# EAGLE design GenieSteroids (EAGLE 5.11)
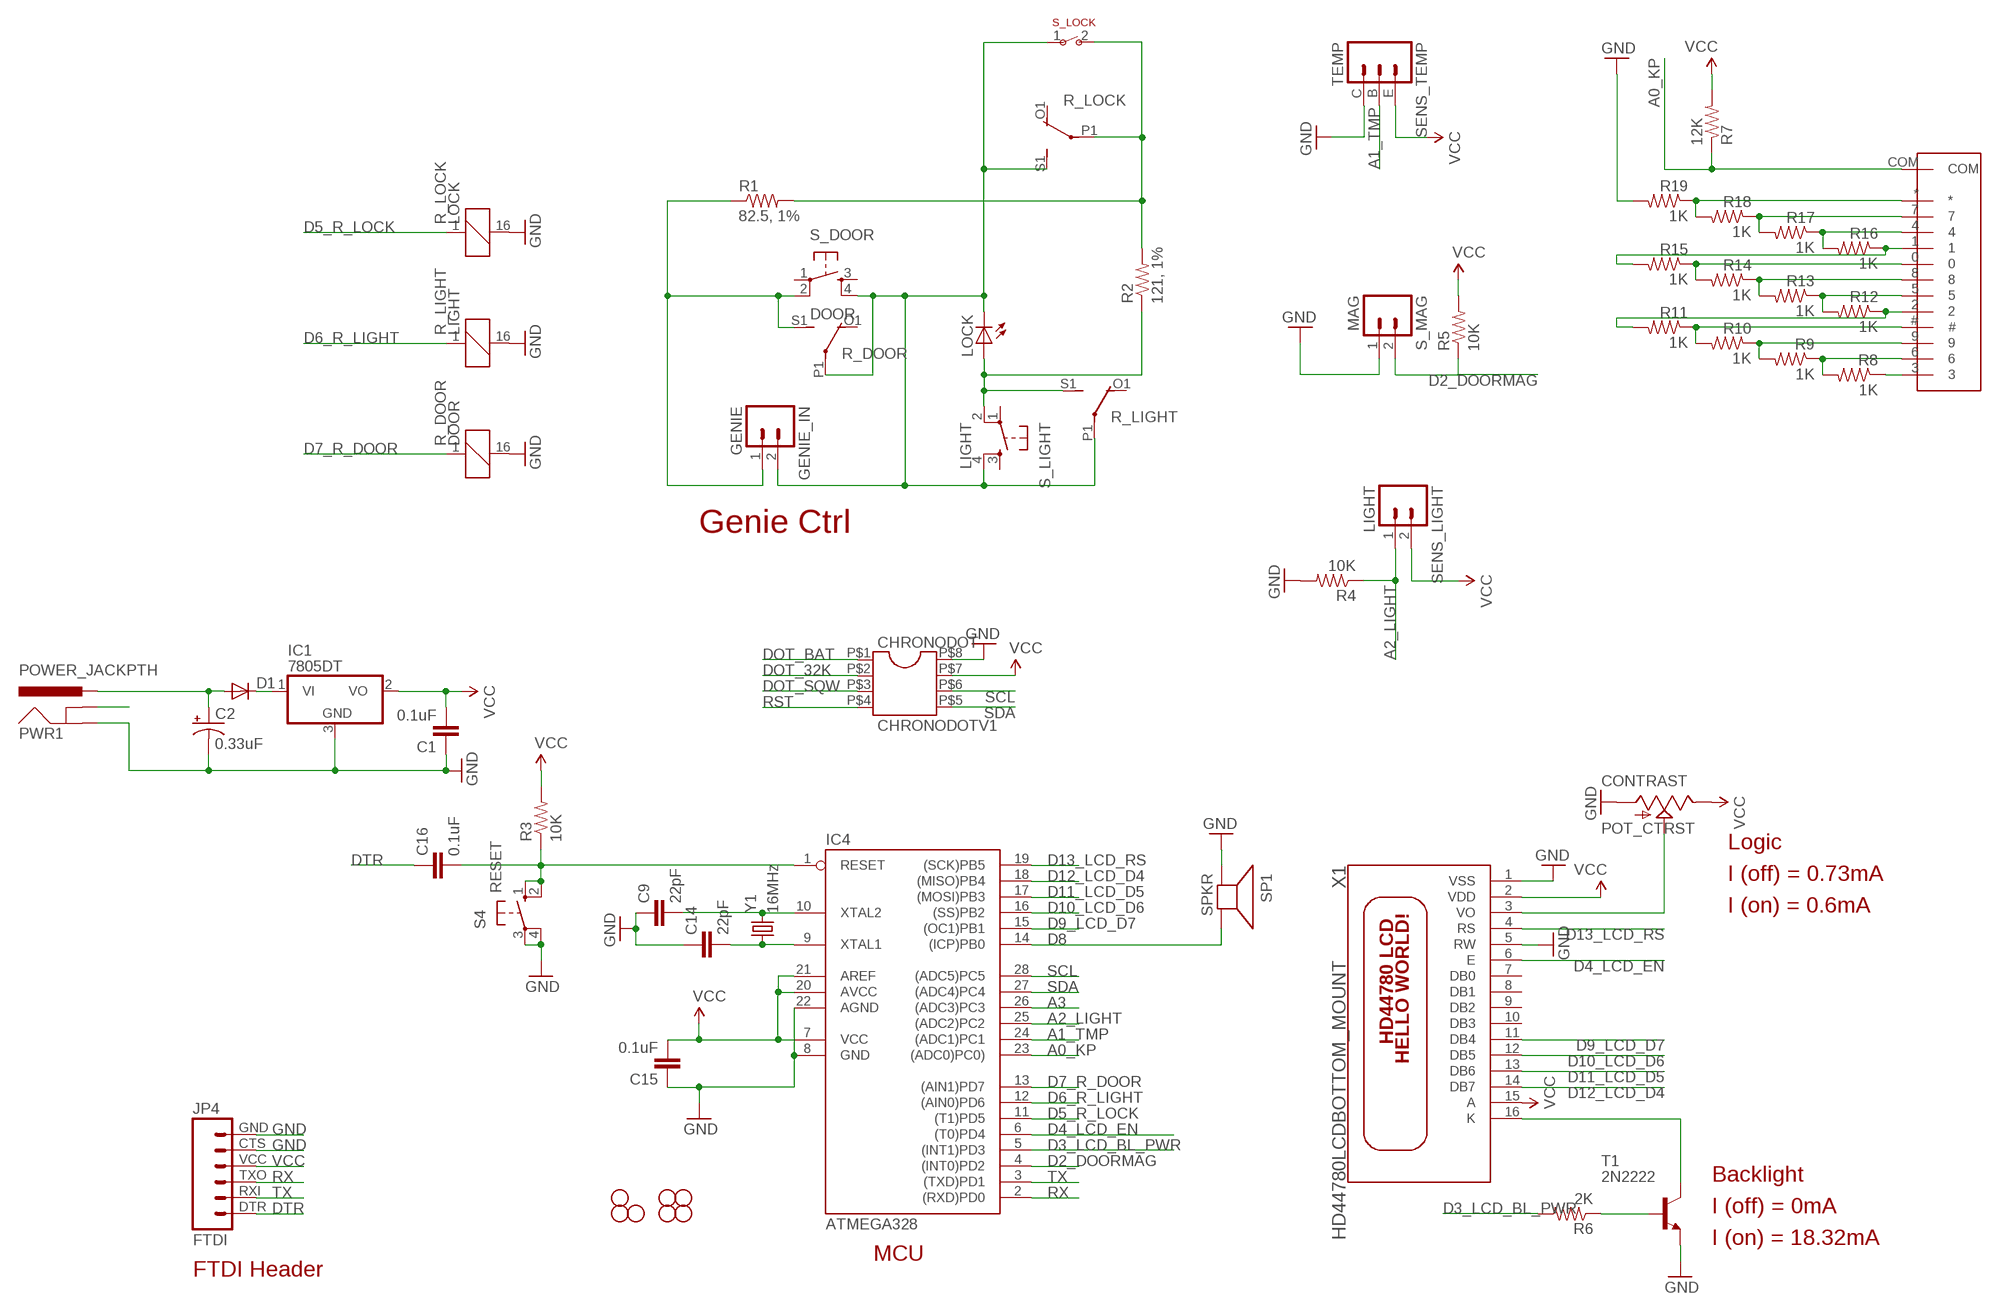
[diagram p0: schematic, sheet 1]

## Parts
C1  0.1uF  CAPPTH1  [CAP-PTH-5MM]
C2  0.33uF  CAP_POLPTH1  [CPOL-RADIAL-100UF-25V]
C9  22pF  CAPPTH  [CAP-PTH-SMALL]
C14  22pF  CAPPTH  [CAP-PTH-SMALL]
C15  0.1uF  CAPPTH  [CAP-PTH-SMALL]
C16  0.1uF  CAPPTH1  [CAP-PTH-5MM]
CHRONODOT  CHRONODOTV1  [CHRONODOT]
D1  DIODEPTH  [DIODE-1N4001]
GENIE_IN  GENIE  M023.5MM  [SCREWTERMINAL-3.5MM-2]
IC1  7805DT  [TO252]
IC4  ATMEGA328  AT90S4433P  [DIL28-3]
JP1  STAND-OFF#2  [STAND-OFF-#2]
JP2  STAND-OFF#2  [STAND-OFF-#2]
JP3  STAND-OFF#2  [STAND-OFF-#2]
JP4  FTDI  FTDI_BASICPTH  [FTDI_BASIC]
JP5  STAND-OFF#2  [STAND-OFF-#2]
JP7  STAND-OFF  [STAND-OFF]
JP8  STAND-OFF  [STAND-OFF]
JP9  STAND-OFF  [STAND-OFF]
LOCK  LED5MM  [LED5MM]
POT_CTRST  CONTRAST  POTVERT  [POT_TRIM_MINI]
PWR1  POWER_JACKPTH  [POWER_JACK_PTH]
R1  82.5, 1%  RESISTORAXIAL-0.3  [AXIAL-0.3]
R2  121, 1%  RESISTORAXIAL-0.3  [AXIAL-0.3]
R3  10K  RESISTORAXIAL-0.3  [AXIAL-0.3]
R4  10K  RESISTORAXIAL-0.3  [AXIAL-0.3]
R5  10K  RESISTORAXIAL-0.3  [AXIAL-0.3]
R6  2K  RESISTORAXIAL-0.3  [AXIAL-0.3]
R7  12K  RESISTORAXIAL-0.3  [AXIAL-0.3]
R8  1K  RESISTORAXIAL-0.3  [AXIAL-0.3]
R9  1K  RESISTORAXIAL-0.3  [AXIAL-0.3]
R10  1K  RESISTORAXIAL-0.3  [AXIAL-0.3]
R11  1K  RESISTORAXIAL-0.3  [AXIAL-0.3]
R12  1K  RESISTORAXIAL-0.3  [AXIAL-0.3]
R13  1K  RESISTORAXIAL-0.3  [AXIAL-0.3]
R14  1K  RESISTORAXIAL-0.3  [AXIAL-0.3]
R15  1K  RESISTORAXIAL-0.3  [AXIAL-0.3]
R16  1K  RESISTORAXIAL-0.3  [AXIAL-0.3]
R17  1K  RESISTORAXIAL-0.3  [AXIAL-0.3]
R18  1K  RESISTORAXIAL-0.3  [AXIAL-0.3]
R19  1K  RESISTORAXIAL-0.3  [AXIAL-0.3]
R_DOOR  DOOR  RELAY-DPDT5V  [D3423]
R_LIGHT  LIGHT  RELAY-DPDT5V  [D3423]
R_LOCK  LOCK  RELAY-DPDT5V  [D3423]
S4  RESET  10-XX  [B3F-10XX]
S_DOOR  DOOR  TAC_SWITCH12MM  [TACTILE-PTH-12MM]
S_LIGHT  LIGHT  TAC_SWITCH12MM  [TACTILE-PTH-12MM]
S_LOCK  LOCK  SWITCH-SPST3.5MMSCREW_TERMINAL  [SCREWTERMINAL-3.5MM-2]
S_MAG  MAG  M023.5MM  [SCREWTERMINAL-3.5MM-2]
SENS_LIGHT  LIGHT  LIGHTSENSORPADS  [1X02_LOCK_LONGPADS]
SENS_TEMP  TEMP  TMP36PTH  [TO92-EBC-OVAL]
SP1  SPKR  SPEAKER/PS12  [PS12]
T1  2N2222  [TO92-EBC-OVAL]
U$2  KEYPAD_12KGENERIC  [KEYPAD_12K]
X1  HD44780LCDBOTTOM_MOUNT  [LCD1602-BOTTOMMOUNT]
Y1  16MHz  CRYSTALHC49US  [HC49US]

## Nets
A0_KP: IC4.23((ADC0)PC0)) R7.P$1 U$2.COM
A1_TMP: IC4.24((ADC1)PC1) SENS_TEMP.B
A2_LIGHT: IC4.25((ADC2)PC2) R4.P$1 SENS_LIGHT.1
A3: IC4.26((ADC3)PC3)
D2_DOORMAG: IC4.4((INT0)PD2) R5.P$1 S_MAG.2
D3_LCD_BL_PWR: IC4.5((INT1)PD3) R6.P$2
D4_LCD_EN: IC4.6((T0)PD4) X1.6(E)
D5_R_LOCK: IC4.11((T1)PD5) R_LOCK.1
D6_R_LIGHT: IC4.12((AIN0)PD6) R_LIGHT.1
D7_R_DOOR: IC4.13((AIN1)PD7) R_DOOR.1
D8: IC4.14((ICP)PB0) SP1.P$2(-)
D9_LCD_D7: IC4.15((OC1)PB1) X1.11(DB4)
D10_LCD_D6: IC4.16((SS)PB2) X1.12(DB5)
D11_LCD_D5: IC4.17((MOSI)PB3) X1.13(DB6)
D12_LCD_D4: IC4.18((MISO)PB4) X1.14(DB7)
D13_LCD_RS: IC4.19((SCK)PB5) X1.4(RS)
DOT_32K: CHRONODOT.P$2
DOT_BAT: CHRONODOT.P$1
DOT_SQW: CHRONODOT.P$3
DTR: C16.1 JP4.DTR
GND [power]: C1.1 C2.2(-) C9.1 C14.1 C15.1 CHRONODOT.P$8 IC1.3(GND) IC4.8(GND) IC4.22(AGND) JP4.CTS JP4.GND POT_CTRST.P$1(A) PWR1.GND R4.P$2 R19.P$2 R_DOOR.16 R_LIGHT.16 R_LOCK.16 S4.3(P) S4.4(P1) S_MAG.1 SENS_TEMP.C SP1.P$1(+) T1.E X1.1(VSS) X1.5(RW)
N$1: GENIE_IN.1 R1.P$1 R_DOOR.S1(2:S) S_DOOR.2
N$2: R1.P$2 R2.P$2 R_LOCK.P1(2:P) S_LOCK.2
N$3 [power]: C2.1(+) D1.A PWR1.PWR
N$4: LOCK.A R2.P$1 R_LIGHT.S1(2:S) S_LIGHT.2
N$5: POT_CTRST.P$2(S) X1.3(VO)
N$6 [power]: D1.C IC1.1(VI)
N$7: R6.P$1 T1.B
N$8: T1.C X1.16(K)
N$10: R8.P$1 U$2.3
N$11: R8.P$2 R9.P$1 U$2.6
N$12: R9.P$2 R10.P$1 U$2.9
N$13: R10.P$2 R11.P$1 U$2.#
N$14: R11.P$2 R12.P$1 U$2.2
N$15: R12.P$2 R13.P$1 U$2.5
N$16: R13.P$2 R14.P$1 U$2.8
N$17: R16.P$2 R17.P$1 U$2.4
N$18: R14.P$2 R15.P$1 U$2.0
N$19: R15.P$2 R16.P$1 U$2.1
N$20: R17.P$2 R18.P$1 U$2.7
N$21: R18.P$2 R19.P$1 U$2.*
N$22 [power]: PWR1.GNDBREAK
RST: C16.2 CHRONODOT.P$4 IC4.1(RESET) R3.P$1 S4.1(S) S4.2(S1)
RX: IC4.2((RXD)PD0) JP4.TXO
S3: GENIE_IN.2 LOCK.K(C) R_DOOR.P1(2:P) R_LIGHT.P1(2:P) R_LOCK.S1(2:S) S_DOOR.4 S_LIGHT.4 S_LOCK.1
SCL: CHRONODOT.P$6 IC4.28((ADC5)PC5)
SDA: CHRONODOT.P$5 IC4.27((ADC4)PC4)
TX: IC4.3((TXD)PD1) JP4.RXI
VCC [power]: C1.2 C15.2 CHRONODOT.P$7 IC1.2(VO) IC4.7(VCC) IC4.20(AVCC) IC4.21(AREF) JP4.VCC POT_CTRST.P$3(E) R3.P$2 R5.P$2 R7.P$2 SENS_LIGHT.2 SENS_TEMP.E X1.2(VDD) X1.15(A)
XTAL1: C14.2 IC4.9(XTAL1) Y1.1
XTAL2: C9.2 IC4.10(XTAL2) Y1.2
Unconnected: R_DOOR.O1(2:O) R_DOOR.O2(3:O) R_DOOR.P2(3:P) R_DOOR.S2(3:S) R_LIGHT.O1(2:O) R_LIGHT.O2(3:O) R_LIGHT.P2(3:P) R_LIGHT.S2(3:S) R_LOCK.O1(2:O) R_LOCK.O2(3:O) R_LOCK.P2(3:P) R_LOCK.S2(3:S) S_DOOR.1 S_DOOR.3 S_LIGHT.1 S_LIGHT.3 X1.7(DB0) X1.8(DB1) X1.9(DB2) X1.10(DB3)

## Notes on the sheet
- Genie Ctrl
- Logic
- I (off) = 0.73mA
- I (on) = 0.6mA
- Backlight
- I (off) = 0mA
- I (on) = 18.32mA
- MCU
- FTDI Header

## Library data of the parts
C1 C9 C14-C16 = SparkFun:CAP: Capacitor Standard 0603 ceramic capacitor, and 0.1" leaded capacitor.
C2 = SparkFun:CAP_POL: Capacitor Polarized These are standard SMD and PTH capacitors. Normally 10uF, 47uF, and 100uF in electrolytic and tantalum varieties. Always verify the external diameter of the through hole cap, it varies with capacity, voltage, and manufacturer. The EIA devices should be standard.
CHRONODOT = Dek:CHRONODOT
D1 = SparkFun:DIODE: Diode These are standard reverse protection diodes and small signal diodes. SMA package can handle up to about 1A. SOD-323 can handle about 200mA. What the SOD-323 package when ordering, there are some mfgs out there that are 5-pin packages.
GENIE_IN S_MAG = SparkFun:M02: Header 2 Standard 2-pin 0.1" header. Use with straight break away headers (SKU : PRT-00116), right angle break away headers (PRT-00553), swiss pins (PRT-00743), machine pins (PRT-00117), and female headers (PRT-00115). Molex polarized connector foot print use with SKU : PRT-08233 with associated crimp pins and housings.
IC1 = adafruit:78*: Positive VOLTAGE REGULATOR Added bigger pads to the TO-92 package
IC4 = atmel:AT90S4433: MICROCONTROLLER 4 Kbytes FLASH 128 bytes SRAM 256 bytes EEPROM UART 6-channel 10 bit ADC; OC_FARNELL: unknown; OC_NEWARK: unknown
JP1-JP3 JP5 = Dek:STAND-OFF: Stand Off
JP4 = Dek:FTDI_BASIC: FTDI Basic: 3.3V and 5V
JP7-JP9 = SparkFun:STAND-OFF: Stand Off
LOCK = SparkFun:LED: LEDs Standard schematic elements and footprints for 5mm, 3mm, 1206, and 0603 sized LEDs. 5mm - Spark Fun Electronics SKU : COM-00529 (and others)
POT_CTRST = Dek:POT
PWR1 = SparkFun:POWER_JACK: Power Jack This is the standard 5.5mm barrel jack for power. The PTH is the most common, proven, reliable, footprint. All others are experimental. The Slot footprint only works if the mill layer is transmitted to the PCB fab house so be warned. Spark Fun Electronics SKU : PRT-00119. Mating wall wart : TOL-00298 (and others)
R1-R19 = SparkFun:RESISTOR: Resistor Basic schematic elements and footprints for 0603, 1206, and PTH resistors.
R_DOOR R_LIGHT R_LOCK = Dek:RELAY-DPDT: RELAY 2 x switch, Omron; OC_FARNELL: unknown; OC_NEWARK: unknown
S4 = switch-omron:10-XX: OMRON SWITCH; MPN: B3F-1000; OC_FARNELL: 176432; OC_NEWARK: 36M3542
S_DOOR S_LIGHT = Dek:TAC_SWITCH: Momentary Switch Button commonly used for reset or general input. Spark Fun Electronics SKU : COM-00097
S_LOCK = Dek:SWITCH-SPST
SENS_LIGHT = Dek:LIGHTSENSOR
SENS_TEMP = Dek:TMP36
SP1 = adafruit:SPEAKER: SPEAKER Source: Buerklin Added PS12 (for part # PS1240 piezo) http://www.ladyada.net/library/pcb/eaglelibrary.html
T1 = adafruit:2N2222: NPN TRANSISTOR Big oval pads
U$2 = Dek:KEYPAD_12K
X1 = Dek:HD44780LCD: HD44780 LCD Standard character type LCDs, available in sizes from 8x1 to 40x4!
Y1 = SparkFun:CRYSTAL: Crystals Various standard crystals. Proven footprints. Spark Fun Electronics SKU : COM-00534

## Net classes
2 old_power: width 0.813 mm, clearance 0.508 mm

## Board
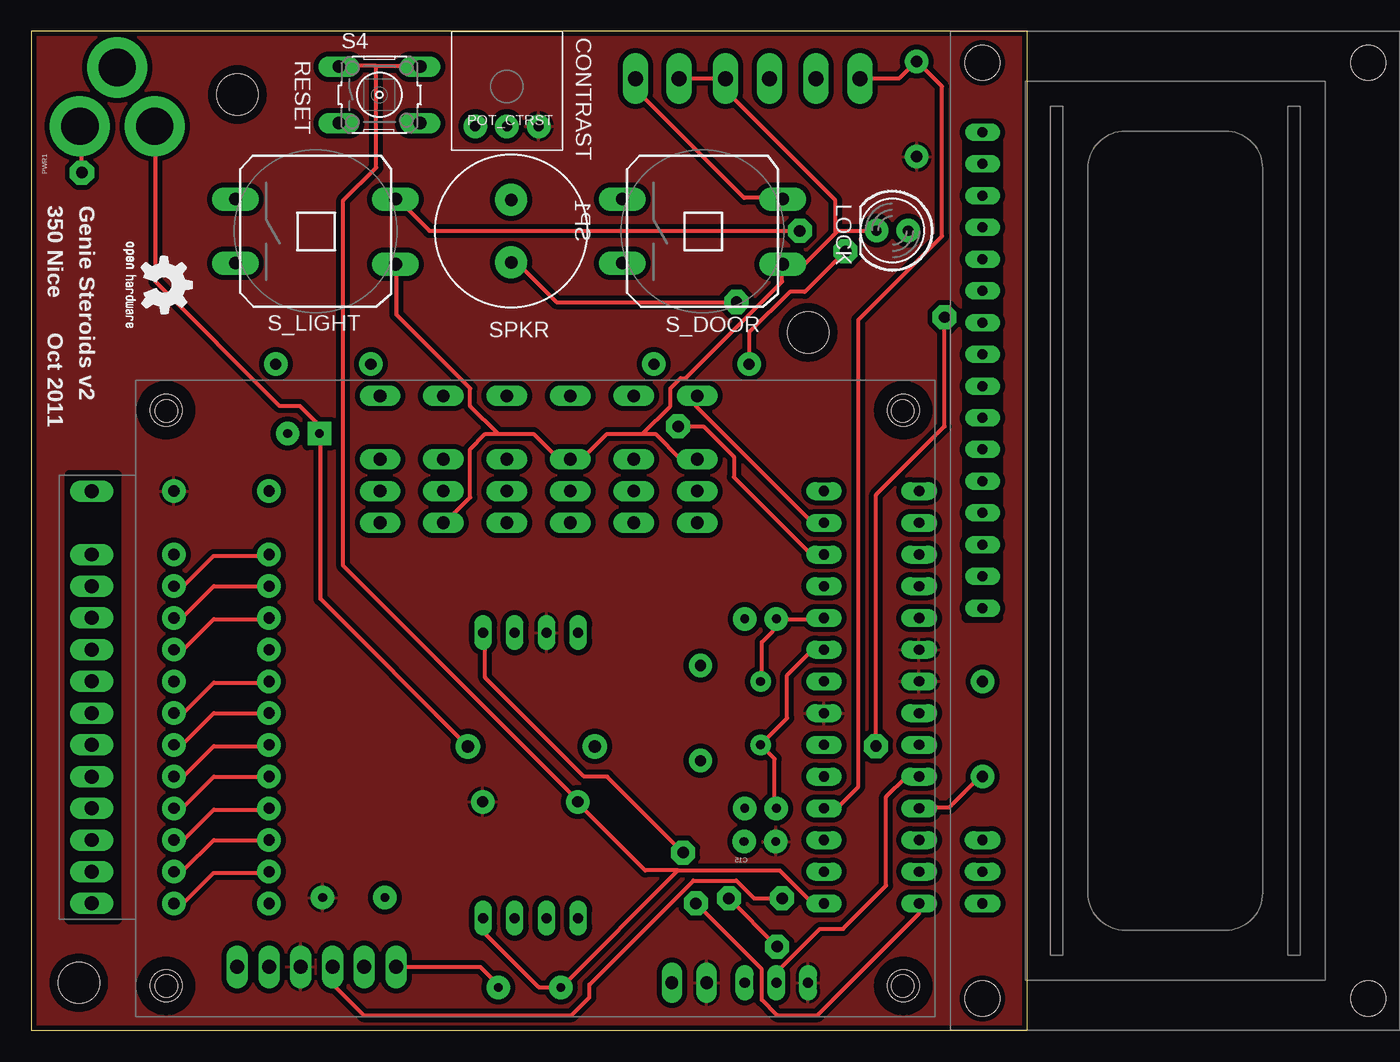
[diagram p1: board, top side]
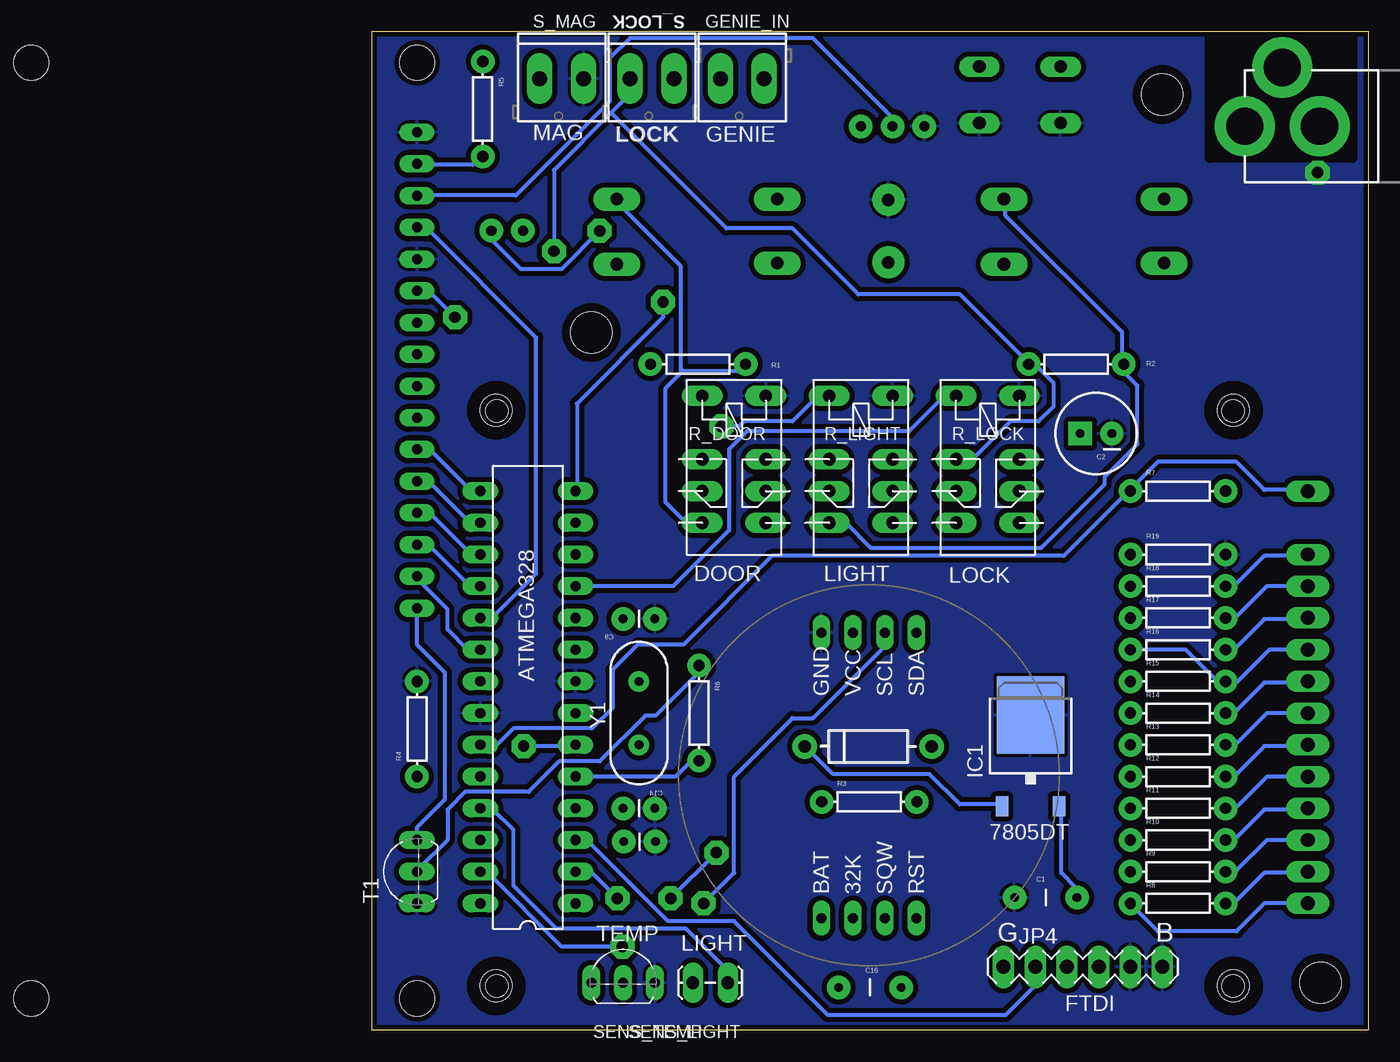
[diagram p2: board, bottom side, seen from below]

Size 79.81 x 80 mm. Coordinates in mm from the lower left corner, seen from the top.
Outline: 0,0 79.81,0 79.81,80 0,80 0,0
Copper layers (1*16): Top 0.035mm / dielectric 1.5mm / Bottom 0.035mm
Design rules "Dek *": minimum track width 12mil, minimum drill 36mil, track to track 12mil, track to pad 12mil, pad to pad 12mil, via to via 12mil, smd to smd 0mil, copper to edge 10mil, drill to drill 12mil, minimum pad ring 12mil, minimum via ring 20mil, stop-mask expansion 4mil, vias tented up to drill 25mil, thermal gap 10mil
tRestrict: area 3,8.9 to 6.9,44.5; area 74.9,33 to 77.5,72.4
bRestrict: area 1.3,69.8 to 12.7,80

### Footprints (pad centres in the part's own frame; a part is rotated, then mirrored left to right if it is on the bottom)
CAP-PTH-5MM = drill 0.7 pad 1.88 round: 1 -2.5,0; 2 2.5,0
CPOL-RADIAL-100UF-25V = drill 0.7 pad 1.88 square: 1 1.27,0 | drill 0.7 pad 1.88 round: 2 -1.27,0
CAP-PTH-SMALL = drill 0.7 pad 1.88 round: 1 0,0; 2 2.54,0
CHRONODOT = drill 0.8 long: P$1 -11.43,3.81; P$2 -11.43,1.27; P$3 -11.43,-1.27; P$4 -11.43,-3.81; P$5 11.43,-3.81; P$6 11.43,-1.27; P$7 11.43,1.27; P$8 11.43,3.81
DIODE-1N4001 = drill 1 pad 1.981 round: A -5.08,0; C 5.08,0
SCREWTERMINAL-3.5MM-2 = drill 1.2 pad 2.032 long: 1 0,0; 2 3.5,0
TO252 = smd 1 x 1.6: 1 -2.28,-4.8; 2 2.28,-4.8 | smd 5.4 x 6.2: 3 0,2.5
DIL28-3 = drill 0.813 long: 1 -16.51,-3.81; 2 -13.97,-3.81; 3 -11.43,-3.81; 4 -8.89,-3.81; 5 -6.35,-3.81; 6 -3.81,-3.81; 7 -1.27,-3.81; 8 1.27,-3.81; 9 3.81,-3.81; 10 6.35,-3.81; 11 8.89,-3.81; 12 11.43,-3.81; 13 13.97,-3.81; 14 16.51,-3.81; 15 16.51,3.81; 16 13.97,3.81; 17 11.43,3.81; 18 8.89,3.81; 19 6.35,3.81; 20 3.81,3.81; 21 1.27,3.81; 22 -1.27,3.81; 23 -3.81,3.81; 24 -6.35,3.81; 25 -8.89,3.81; 26 -11.43,3.81; 27 -13.97,3.81; 28 -16.51,3.81
STAND-OFF-#2 = hole 2.54: 0,0
FTDI_BASIC = drill 1.118 long: CTS 10.16,0; DTR 0,0; GND 12.7,0; RXI 2.54,0; TXO 5.08,0; VCC 7.62,0
STAND-OFF = hole 3.302: 0,0
LED5MM = drill 0.813 pad 1.88 round: A -1.27,0; K 1.27,0
POT_TRIM_MINI = drill 0.8 pad 1.88 round: P$1 2.54,2.54; P$2 5.08,2.54; P$3 7.62,2.54
POWER_JACK_PTH = drill 2.997 pad 4.826 round: GND 0,7.7; GNDBREAK 4.7,10.7; PWR 0,13.7
AXIAL-0.3 = drill 0.9 pad 1.88 round: P$1 -3.81,0; P$2 3.81,0
D3423 = drill 1.016 long: 1 -5.08,-2.54; 16 -5.08,2.54; O1 2.54,-2.54; O2 2.54,2.54; P1 0,-2.54; P2 0,2.54; S1 5.08,-2.54; S2 5.08,2.54
B3F-10XX = drill 1.016 long: 1 -3.251,2.261; 2 3.251,2.261; 3 -3.251,-2.261; 4 3.251,-2.261
TACTILE-PTH-12MM = drill 1.016 pad 1.88 long: 1 -6.416,2.561; 2 6.416,2.561; 3 -6.416,-2.561; 4 6.416,-2.661
1X02_LOCK_LONGPADS = drill 1.016 long: 1 -0.127,0; 2 2.667,0
TO92-EBC-OVAL = drill 0.813 long: B 0,-1.27; C 2.54,-1.27; E -2.54,-1.27
PS12 = drill 1 pad 2.54 round: P$1 -2.5,0; P$2 2.5,0
KEYPAD_12K = drill 1.118 long: 0 24.13,-1.505; 1 21.59,-1.505; 2 31.75,-1.505; 3 41.91,-1.505; 4 19.05,-1.505; 5 29.21,-1.505; 6 39.37,-1.505; 7 16.51,-1.505; 8 26.67,-1.505; 9 36.83,-1.505; # 34.29,-1.505; * 13.97,-1.505; COM 8.89,-1.505 | hole 1.778: 2.47,4.47; 48.53,4.47; 48.53,63.455; 2.47,63.455
LCD1602-BOTTOMMOUNT = drill 0.8 long: 1 8.1,2.56; 2 10.64,2.56; 3 13.18,2.56; 4 15.72,2.56; 5 18.26,2.56; 6 20.8,2.56; 7 23.34,2.56; 8 25.88,2.56; 9 28.42,2.56; 10 30.96,2.56; 11 33.5,2.56; 12 36.04,2.56; 13 38.58,2.56; 14 41.12,2.56; 15 43.66,2.56; 16 46.2,2.56 | hole 2.8: 2.54,2.54; 2.54,33.46; 77.46,33.46; 77.46,2.54
HC49US = drill 0.7 pad 1.651 round: 1 -2.54,0; 2 2.54,0

### Placement (x,y rotation side)
C1  25.84,10.63 0 bottom
C2  21.81,47.78 180 bottom
C9  57.15,32.95 180 bottom
C14  57.15,17.78 180 bottom
C15  57.1,15.11 180 bottom
C16  39.92,3.44 180 bottom
CHRONODOT  40.01,20.41 90 bottom
D1  40.06,22.73 180 bottom
GENIE_IN  48.39,76.2 180 bottom
IC1  27.05,22.73 0 bottom
IC4  67.31,26.67 90 bottom
JP1  10.79,3.56 0 top
JP2  69.85,3.56 0 top
JP3  10.79,49.66 0 top
JP4  29.21,5.08 0 bottom
JP5  69.85,49.66 0 top
JP7  62.23,55.88 0 top
JP8  3.81,3.81 0 top
JP9  16.51,74.93 0 top
LOCK  68.98,64.03 180 top
POT_CTRST  33.02,69.85 0 top
PWR1  -3.81,72.39 90 bottom
R1  53.69,53.34 180 bottom
R2  23.4,53.34 180 bottom
R3  39.97,18.3 0 bottom
R4  76.2,24.13 90 bottom
R5  70.93,73.77 270 bottom
R6  53.61,25.4 270 bottom
R7  15.24,43.18 0 bottom
R8  15.24,10.16 0 bottom
R9  15.24,12.7 0 bottom
R10  15.24,15.24 0 bottom
R11  15.24,17.78 0 bottom
R12  15.24,20.32 0 bottom
R13  15.24,22.86 0 bottom
R14  15.24,25.4 0 bottom
R15  15.24,27.94 0 bottom
R16  15.24,30.48 0 bottom
R17  15.24,33.02 0 bottom
R18  15.24,35.56 0 bottom
R19  15.24,38.1 0 bottom
R_DOOR  50.8,45.72 270 bottom
R_LIGHT  40.64,45.72 270 bottom
R_LOCK  30.48,45.72 270 bottom
S4  27.9,74.91 0 top
S_DOOR  53.77,64 0 top
S_LIGHT  22.77,64 0 top
S_LOCK  55.63,76.2 180 bottom
S_MAG  62.87,76.2 180 bottom
SENS_LIGHT  51.44,3.81 180 bottom
SENS_TEMP  59.69,5.08 0 bottom
SP1  38.45,64 270 top
T1  77.47,12.7 90 bottom
U$1  [OSHW2]  6.35,63.5 270 top
U$2  6.35,52.07 270 top
X1  73.64,80.01 270 top
Y1  58.42,25.4 90 bottom

### Tracks (layer width: path | path; a pad name or v marks a point on that pad's centre or on a via)
A0_KP
  Bottom 0.305: 19.1,43.28 24.38,38 47.75,38 54.86,30.89 58.52,30.89 60.55,28.85 60.55,25.81 62.18,24.18 68.48,24.18 69.7,22.96 71.12,22.96 IC4.23 | 19.1,43.28 16.87,45.52 10.57,45.52 8.33,43.28 4.88,43.28 U$2.COM | 19.1,43.28 R7.P$1
A1_TMP
  Top 0.305: IC4.24 70.1,20.32 68.48,18.69 68.48,11.58 65.02,8.13 63.2,8.13 59.74,4.67 59.74,3.86 SENS_TEMP.B
A2_LIGHT
  Top 0.305: R4.P$1 76,20.32 73.56,17.88 71.12,17.88 IC4.25
  Bottom 0.305: SENS_LIGHT.1 51.41,3.86 51.41,4.88 54.66,8.13 65.02,8.13 68.48,11.58 68.48,16.05 70.1,17.68 71.12,17.68 IC4.25
D2_DOORMAG
  Top 0.305: IC4.4 63.6,17.88 64.62,17.88 66.24,19.51 66.24,56.9 72.95,63.6 72.95,75.59 71.12,77.42 R5.P$1 70.92,77.62 69.49,76.2 S_MAG.2
D3_LCD_BL_PWR
  Bottom 0.305: IC4.5 55.47,20.32 54.25,21.54 53.65,21.54 R6.P$2
D4_LCD_EN  (via drill 0.91)
  Top 0.305: v73.15,57.1 73.15,48.36 67.67,42.88 v67.67,22.76
  Bottom 0.305: v73.15,57.1 75.18,59.13 76.2,59.13 X1.6 | v67.67,22.76 63.6,22.76 IC4.6
D5_R_LOCK
  Bottom 0.305: IC4.11 55.68,35.56 51.21,40.03 51.21,46.53 49.78,47.95 36.78,47.95 33.93,50.8 R_LOCK.1
D6_R_LIGHT  (via drill 0.91)
  Top 0.305: v51.82,48.36 53.85,48.36 56.29,45.92 56.29,44.3 62.38,38.2 63.4,38.2 IC4.12
  Bottom 0.305: v51.82,48.36 50.39,48.36 49.99,48.77 46.13,48.77 44.09,50.8 R_LIGHT.1
D7_R_DOOR
  Top 0.305: IC4.13 62.59,40.64 53.24,49.99 53.24,50.8 R_DOOR.1
D8  (via drill 0.91)
  Top 0.305: v56.49,58.32 42.06,58.32 39.01,61.37 38.61,61.37 SP1.P$2
  Bottom 0.305: v56.49,58.32 56.49,57.1 63.4,50.19 63.4,43.28 IC4.14
D9_LCD_D7
  Bottom 0.305: X1.11 76.2,46.33 74.98,46.33 71.93,43.28 71.12,43.28 IC4.15
D10_LCD_D6
  Bottom 0.305: IC4.16 71.93,40.64 75.18,43.89 76.2,43.89 X1.12
D11_LCD_D5
  Bottom 0.305: X1.13 76.2,41.25 74.98,41.25 71.93,38.2 71.12,38.2 IC4.17
D12_LCD_D4
  Bottom 0.305: IC4.18 71.93,35.56 75.18,38.81 76.2,38.81 X1.14
D13_LCD_RS
  Bottom 0.305: X1.4 76.2,64.21 75.39,64.21 66.65,55.47 66.65,36.58 70.1,33.12 71.12,33.12 IC4.19
DTR
  Top 0.305: JP4.DTR 35.97,5.08 37.59,3.45 C16.1
GND  (via drill 0.91)
  Top 0.305: v4.06,68.68 4.06,72.34 PWR1.GND
  pour Bottom (isolate 0.406): -1.27,81.28 110.49,81.28 110.49,-2.54 -1.27,-2.54
N$1
  Top 0.305: S_DOOR.2 60.15,66.65 57.1,66.65 48.56,75.18 48.56,76.2 GENIE_IN.1
  Bottom 0.305: 54.97,52.73 54.86,52.83 50.39,52.83 49.99,53.24 R1.P$1 | 54.97,52.73 56.29,51.41 56.29,42.27 54.66,40.64 R_DOOR.S1 | 54.97,52.73 55.07,52.83 55.07,61.16 60.35,66.45 S_DOOR.2
N$2  (via drill 0.91)
  Top 0.305: v65.23,62.38 61.98,59.13 60.76,59.13 57.51,55.88 57.51,53.44 R1.P$2
  Bottom 0.305: R_LOCK.P1 31.7,45.72 28.65,48.77 26.42,48.77 25.2,49.99 25.2,51.82 26.62,53.24 27.03,53.24 R2.P$2 27.23,53.44 32.72,58.93 40.84,58.93 46.13,64.21 51.41,64.21 60.66,73.46 | v65.23,62.38 65.23,68.89 60.66,73.46 | 60.66,73.46 59.13,74.98 S_LOCK.2
N$3
  Top 0.305: D1.A 34.95,22.76 23.16,34.54 23.16,47.75 C2.1 22.96,47.95 22.96,48.56 21.54,49.99 19.91,49.99 9.96,59.94 9.96,72.34 PWR1.PWR
N$4  (via drill 0.91)
  Top 0.305: v61.57,64.01 31.9,64.01 29.26,66.65 S_LIGHT.2
  Bottom 0.305: R_LIGHT.S1 41.86,40.64 39.83,38.61 26.21,38.61 21.13,43.69 21.13,44.3 18.49,46.94 18.49,51.61 19.51,52.63 19.51,53.24 R2.P$1 19.71,53.44 19.71,55.88 29.06,65.23 29.06,66.45 S_LIGHT.2 | v61.57,64.01 64.62,60.96 67.87,60.96 70.1,63.2 70.1,64.01 LOCK.A
N$5
  Bottom 0.305: X1.3 76.2,66.85 68.28,66.85 60.76,74.37 60.76,77.83 59.13,79.45 44.5,79.45 38.2,73.15 38.2,72.54 POT_CTRST.P$2
N$6
  Bottom 0.305: IC1.1 29.46,18.09 32.72,18.09 35.15,20.52 42.88,20.52 45.11,22.76 D1.C
N$7
  Bottom 0.305: T1.B 76.2,12.8 73.76,15.24 73.76,17.68 72.34,19.1 67.26,19.1 64.82,21.54 61.57,21.54 57.91,25.2 57.1,25.2 53.65,28.65 53.65,29.06 R6.P$1
N$8
  Bottom 0.305: T1.C 76.2,16.26 73.97,18.49 73.97,28.65 76.2,30.89 X1.16
N$10
  Bottom 0.305: U$2.3 8.33,10.16 10.57,7.92 16.87,7.92 19.1,10.16 R8.P$1
N$11
  Top 0.305: R9.P$1 18.9,12.6 14.63,12.6 12.19,10.16 R8.P$2
  Bottom 0.305: U$2.6 4.88,12.6 8.33,12.6 10.77,10.16 R8.P$2
N$12
  Top 0.305: R10.P$1 14.63,15.24 12.19,12.8 11.58,12.8 R9.P$2
  Bottom 0.305: U$2.9 8.13,15.24 10.57,12.8 11.38,12.8 R9.P$2
N$13
  Top 0.305: R11.P$1 18.9,17.68 14.63,17.68 12.19,15.24 R10.P$2
  Bottom 0.305: U$2.# 4.88,17.68 8.33,17.68 10.77,15.24 R10.P$2
N$14
  Top 0.305: R12.P$1 14.63,20.32 12.19,17.88 11.58,17.88 R11.P$2
  Bottom 0.305: U$2.2 8.13,20.32 10.57,17.88 11.38,17.88 R11.P$2
N$15
  Top 0.305: R13.P$1 18.9,22.76 14.63,22.76 12.19,20.32 R12.P$2
  Bottom 0.305: U$2.5 4.88,22.76 8.33,22.76 10.77,20.32 R12.P$2
N$16
  Top 0.305: R14.P$1 14.63,25.4 12.19,22.96 11.58,22.96 R13.P$2
  Bottom 0.305: U$2.8 8.13,25.4 10.57,22.96 11.38,22.96 R13.P$2
N$17
  Top 0.305: R17.P$1 18.9,32.92 14.63,32.92 12.19,30.48 R16.P$2
  Bottom 0.305: U$2.4 4.88,32.92 8.33,32.92 10.77,30.48 R16.P$2
N$18
  Top 0.305: R15.P$1 18.9,27.84 14.63,27.84 12.19,25.4 R14.P$2
  Bottom 0.305: U$2.0 4.88,27.84 8.33,27.84 10.77,25.4 R14.P$2
N$19
  Bottom 0.305: U$2.1 7.92,30.48 10.57,27.84 11.38,27.84 R15.P$2 11.58,28.04 12.19,28.04 14.63,30.48 R16.P$1
N$20
  Top 0.305: R18.P$1 14.63,35.56 12.19,33.12 11.58,33.12 R17.P$2
  Bottom 0.305: U$2.7 8.13,35.56 10.57,33.12 11.38,33.12 R17.P$2
N$21
  Top 0.305: R19.P$1 18.9,38 14.63,38 12.19,35.56 R18.P$2
  Bottom 0.305: U$2.* 4.88,38 8.33,38 10.77,35.56 R18.P$2
RST
  Top 0.305: CHRONODOT.P$4 36.37,8.94 36.37,7.72 40.64,3.45 42.27,3.45 C16.2 42.47,3.45 51.82,12.8 | 27.64,77.22 31.09,77.22 S4.2 | 27.64,77.22 24.79,77.22 S4.1 | 51.82,12.8 49.17,12.8 43.69,18.29 R3.P$1 43.69,18.49 24.99,37.19 24.99,66.45 27.64,69.09 27.64,77.22 | 51.82,12.8 59.94,12.8 62.59,10.16 IC4.1
RX  (via drill 0.91)
  Top 0.305: v60.15,10.57 57.91,10.57 56.49,11.99 53.03,11.99 44.7,3.66 44.7,2.64 43.28,1.22 26.62,1.22 24.18,3.66 24.18,5.08 JP4.TXO
  Bottom 0.305: v60.15,10.57 62.18,12.6 63.4,12.6 IC4.2
S3
  Top 0.305: GENIE_IN.2 S_LOCK.1 55.68,76.2 55.68,75.18 64.41,66.45 64.41,64.01 64.52,63.91 | 64.52,63.91 64.62,64.01 67.67,64.01 LOCK.K | 64.52,63.91 61.98,61.37 60.35,61.37 S_DOOR.4 60.15,61.16 60.15,59.94 52.43,52.22 52.02,52.22 51.21,51.41 51.21,49.99 48.97,47.75 | 37.39,47.75 40.23,47.75 42.27,45.72 R_LIGHT.P1 44.09,45.72 46.13,47.75 48.97,47.75 | 37.39,47.75 36.37,47.75 35.15,46.53 35.15,42.67 33.12,40.64 R_LOCK.S1 | 48.97,47.75 49.99,47.75 52.02,45.72 R_DOOR.P1 | 37.39,47.75 35.15,49.99 35.15,51.41 29.26,57.3 29.26,61.16 S_LIGHT.4
SCL  (via drill 0.91)
  Top 0.305: v53.24,10.16 58.52,4.88 58.52,2.44 59.74,1.22 62.99,1.22 71.12,9.35 IC4.28
  Bottom 0.305: v53.24,10.16 50.8,12.6 50.8,20.32 46.13,24.99 44.5,24.99 38.81,30.68 38.81,31.7 CHRONODOT.P$6
SDA  (via drill 0.91)
  Top 0.305: v52.22,14.22 46.13,20.32 44.3,20.32 36.37,28.25 36.37,31.7 CHRONODOT.P$5 | v59.74,6.71 v55.88,10.57
  Bottom 0.305: v55.88,10.57 v52.22,14.22 | v59.74,6.71 64.62,6.71 70.51,12.6 71.12,12.6 IC4.27
TX
  Bottom 0.305: IC4.3 62.59,15.24 56.08,8.74 50.8,8.74 43.28,1.22 29.06,1.22 26.82,3.45 26.82,5.08 JP4.RXI
VCC
  Bottom 0.305: IC1.2 24.59,17.88 24.59,12.6 23.37,11.38 23.37,10.77 C1.2 | IC4.20 72.14,30.48 73.76,32.11 73.76,33.73 76.2,36.17 X1.15 | X1.2 76.2,69.29 71.73,69.29 71.12,69.9 R5.P$2
  pour Top (isolate 0.406): -2.54,81.28 110.49,81.28 110.49,-2.54 -2.54,-2.54
XTAL1
  Top 0.305: IC4.9 62.59,30.48 60.55,28.45 60.55,24.99 Y1.1 59.54,21.74 59.54,17.88 C14.2
XTAL2
  Top 0.305: 60.35,32.92 59.74,32.92 C9.2 60.35,32.92 | 60.35,32.92 63.4,32.92 IC4.10 | 60.35,32.92 58.52,31.09 58.52,28.04 Y1.2

### Text on the board
tPlace: 350 Nice | Genie Steroids v2 | Oct 2011